# EAGLE design Adafruit Motor Bonnet Rev B (EAGLE 9.6.2)
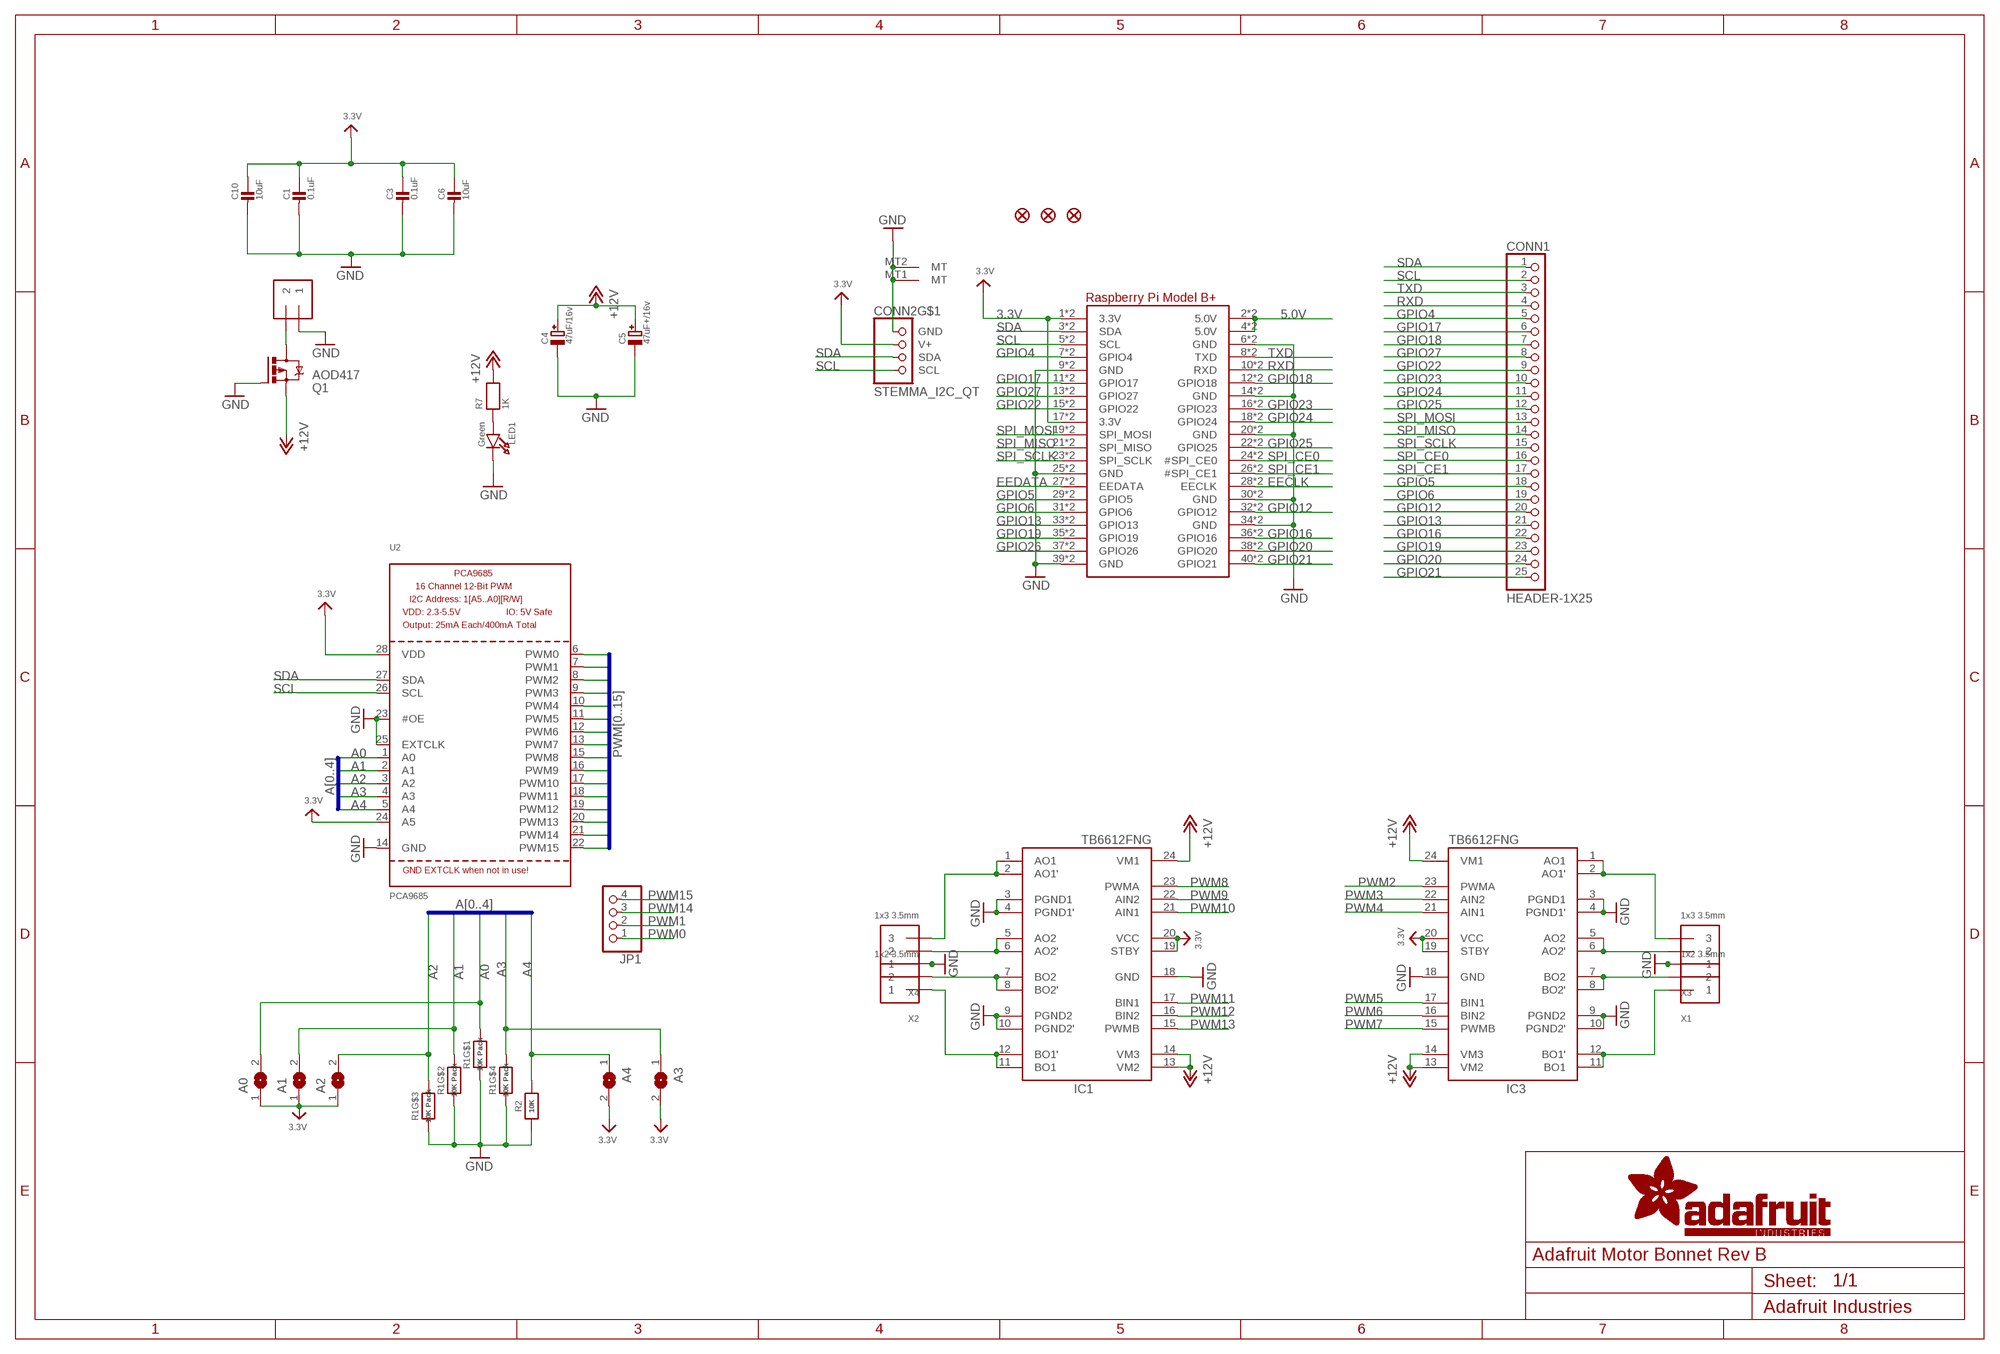
[diagram p0: schematic, sheet 1]

## Parts
A0  SOLDERJUMPERREFLOW_NOPASTE  [SOLDERJUMPER_REFLOW_NOPASTE]
A1  SOLDERJUMPERREFLOW_NOPASTE  [SOLDERJUMPER_REFLOW_NOPASTE]
A2  SOLDERJUMPERREFLOW_NOPASTE  [SOLDERJUMPER_REFLOW_NOPASTE]
A3  SOLDERJUMPERREFLOW_NOPASTE  [SOLDERJUMPER_REFLOW_NOPASTE]
A4  SOLDERJUMPERREFLOW_NOPASTE  [SOLDERJUMPER_REFLOW_NOPASTE]
C1  0.1uF  CAP_CERAMIC0603_NO  [0603-NO]
C3  0.1uF  CAP_CERAMIC0603_NO  [0603-NO]
C4  47uF/16v  CAP_ELECTROLYTICPANASONIC_C  [PANASONIC_C]
C5  47uF+/16v  CAP_ELECTROLYTICPANASONIC_C  [PANASONIC_C]
C6  10uF  CAP_CERAMIC0805-NOOUTLINE  [0805-NO]
C10  10uF  CAP_CERAMIC0805-NOOUTLINE  [0805-NO]
CONN1  HEADER-1X25  [1X25_ROUND_70MIL]
CONN2  STEMMA_I2C_QT  [JST_SH4]
FID1  FIDUCIAL_1MM  [FIDUCIAL_1MM]
FID2  FIDUCIAL_1MM  [FIDUCIAL_1MM]
FID3  FIDUCIAL_1MM  [FIDUCIAL_1MM]
IC1  TB6612FNG  [SSOP24]
IC3  TB6612FNG  [SSOP24]
JP1  HEADER-1X4ROUND  [1X04_ROUND]
LED1  Green  LED0805_NOOUTLINE  [CHIPLED_0805_NOOUTLINE]
MPOWER  1x2 3.5mm  TERMBLOCK_1X2_3.5MM  [TERMBLOCK_1X2-3.5MM]
Q1  AOD417  IRFR5305  [D-PAK_TO252AA]
R1  10K Pack  RESISTOR_4PACK  [RESPACK_4X0603]
R2  10K  RESISTOR_0603_NOOUT  [0603-NO]
R7  1K  RESISTOR_0603_NOOUT  [0603-NO]
RPI1  RASPBERRYPI_BPLUS_BONNET_THMSMT  [PI_BONNET_THMSMT]
U2  PCA9685  [TSSOP28]
X1  1x2 3.5mm  TERMBLOCK_1X2_3.5MM  [TERMBLOCK_1X2-3.5MM]
X2  1x2 3.5mm  TERMBLOCK_1X2_3.5MM  [TERMBLOCK_1X2-3.5MM]
X3  1x3 3.5mm  TERMBLOCK_1X3  [TERMBLOCK_1X3-3.5MM]
X4  1x3 3.5mm  TERMBLOCK_1X3  [TERMBLOCK_1X3-3.5MM]

## Nets
3.3V: A0.1 A1.1 A2.1 A3.2 A4.2 C1.1 C3.1 C6.1 C10.1 CONN2.2(V+) IC1.19(STBY) IC1.20(VCC) IC3.19(STBY) IC3.20(VCC) RPI1.1(3.3V) RPI1.17(3.3V) RPI1.S1(3.3V) RPI1.S17(3.3V) U2.24(A5) U2.28(VDD)
5.0V: RPI1.2(5.0V) RPI1.4(5.0V) RPI1.S2(5.0V) RPI1.S4(5.0V)
+12V: C4.+ C5.+ IC1.13(VM2) IC1.14(VM3) IC1.24(VM1) IC3.13(VM2) IC3.14(VM3) IC3.24(VM1) Q1.3(S) R7.2
A0: A0.2 R1.8 U2.1(A0)
A1: A1.2 R1.7 U2.2(A1)
A2: A2.2 R1.6 U2.3(A2)
A3: A3.1 R1.5 U2.4(A3)
A4: A4.1 R2.2 U2.5(A4)
EECLK: RPI1.28(EECLK) RPI1.S28(EECLK)
EEDATA: RPI1.27(EEDATA) RPI1.S27(EEDATA)
GND: C1.2 C3.2 C4.- C5.- C6.2 C10.2 CONN2.1(GND) CONN2.MT1(MT) CONN2.MT2(MT) IC1.3(PGND1) IC1.4(PGND1') IC1.9(PGND2) IC1.10(PGND2') IC1.18(GND) IC3.3(PGND1) IC3.4(PGND1') IC3.9(PGND2) IC3.10(PGND2') IC3.18(GND) LED1.C MPOWER.1 Q1.1(G) R1.1 R1.2 R1.3 R1.4 R2.1 RPI1.6(GND) RPI1.9(GND) RPI1.14(GND) RPI1.20(GND) RPI1.25(GND) RPI1.30(GND) RPI1.34(GND) RPI1.39(GND) RPI1.S6(GND) RPI1.S9(GND) RPI1.S14(GND) RPI1.S20(GND) RPI1.S25(GND) RPI1.S30(GND) RPI1.S34(GND) RPI1.S39(GND) U2.14(GND) U2.23(#OE) U2.25(EXTCLK) X3.1 X4.1
GPIO4: CONN1.5 RPI1.7(GPIO4) RPI1.S7(GPIO4)
GPIO5: CONN1.18 RPI1.29(GPIO5) RPI1.S29(GPIO5)
GPIO6: CONN1.19 RPI1.31(GPIO6) RPI1.S31(GPIO6)
GPIO12: CONN1.20 RPI1.32(GPIO12) RPI1.S32(GPIO12)
GPIO13: CONN1.21 RPI1.33(GPIO13) RPI1.S33(GPIO13)
GPIO16: CONN1.22 RPI1.36(GPIO16) RPI1.S36(GPIO16)
GPIO17: CONN1.6 RPI1.11(GPIO17) RPI1.S11(GPIO17)
GPIO18: CONN1.7 RPI1.12(GPIO18) RPI1.S12(GPIO18)
GPIO19: CONN1.23 RPI1.35(GPIO19) RPI1.S35(GPIO19)
GPIO20: CONN1.24 RPI1.38(GPIO20) RPI1.S38(GPIO20)
GPIO21: CONN1.25 RPI1.40(GPIO21) RPI1.S40(GPIO21)
GPIO22: CONN1.9 RPI1.15(GPIO22) RPI1.S15(GPIO22)
GPIO23: CONN1.10 RPI1.16(GPIO23) RPI1.S16(GPIO23)
GPIO24: CONN1.11 RPI1.18(GPIO24) RPI1.S18(GPIO24)
GPIO25: CONN1.12 RPI1.22(GPIO25) RPI1.S22(GPIO25)
GPIO26: RPI1.37(GPIO26) RPI1.S37(GPIO26)
GPIO27: CONN1.8 RPI1.13(GPIO27) RPI1.S13(GPIO27)
M1A: IC1.1(AO1) IC1.2(AO1') X4.3
M1B: IC1.5(AO2) IC1.6(AO2') X4.2
M2A: IC1.11(BO1) IC1.12(BO1') X2.1
M2B: IC1.7(BO2) IC1.8(BO2') X2.2
M3A: IC3.1(AO1) IC3.2(AO1') X3.3
M3B: IC3.5(AO2) IC3.6(AO2') X3.2
M4A: IC3.11(BO1) IC3.12(BO1') X1.1
M4B: IC3.7(BO2) IC3.8(BO2') X1.2
N$1: LED1.A R7.1
PWM0: JP1.1 U2.6(PWM0)
PWM1: JP1.2 U2.7(PWM1)
PWM2: IC3.23(PWMA) U2.8(PWM2)
PWM3: IC3.22(AIN2) U2.9(PWM3)
PWM4: IC3.21(AIN1) U2.10(PWM4)
PWM5: IC3.17(BIN1) U2.11(PWM5)
PWM6: IC3.16(BIN2) U2.12(PWM6)
PWM7: IC3.15(PWMB) U2.13(PWM7)
PWM8: IC1.23(PWMA) U2.15(PWM8)
PWM9: IC1.22(AIN2) U2.16(PWM9)
PWM10: IC1.21(AIN1) U2.17(PWM10)
PWM11: IC1.17(BIN1) U2.18(PWM11)
PWM12: IC1.16(BIN2) U2.19(PWM12)
PWM13: IC1.15(PWMB) U2.20(PWM13)
PWM14: JP1.3 U2.21(PWM14)
PWM15: JP1.4 U2.22(PWM15)
RXD: CONN1.4 RPI1.10(RXD) RPI1.S10(RXD)
SCL: CONN1.2 CONN2.4(SCL) RPI1.5(SCL) RPI1.S5(SCL) U2.26(SCL)
SDA: CONN1.1 CONN2.3(SDA) RPI1.3(SDA) RPI1.S3(SDA) U2.27(SDA)
SPI_CE0: CONN1.16 RPI1.24(#SPI_CE0) RPI1.S24(#SPI_CE0)
SPI_CE1: CONN1.17 RPI1.26(#SPI_CE1) RPI1.S26(#SPI_CE1)
SPI_MISO: CONN1.14 RPI1.21(SPI_MISO) RPI1.S21(SPI_MISO)
SPI_MOSI: CONN1.13 RPI1.19(SPI_MOSI) RPI1.S19(SPI_MOSI)
SPI_SCLK: CONN1.15 RPI1.23(SPI_SCLK) RPI1.S23(SPI_SCLK)
TXD: CONN1.3 RPI1.8(TXD) RPI1.S8(TXD)
VMOTOR: MPOWER.2 Q1.4(D)

## Buses
PWM[0..15]
A[0..4]

## Library data of the parts
A0 A1-A4 = microbuilder:SOLDERJUMPER: SMD Solder JUMPER Solder the two pads together to create a connection, or remove the solder to break it. REFLOW - Use this footprint for solder paste and reflow ovens. WAVE - Use this footprint for hand-soldering (larger pads). CLOSED - Has a trace between the two pads to ensure it is closed by default. The trace needs to be cut to disable the jumper, and can be closed again by creating a solder bridge between the two pads.
C1 C3 C6 C10 = microbuilder:CAP_CERAMIC: Ceramic Capacitors For new designs, use the packages preceded by an '_' character since they are more reliable: The following footprints should be used on most boards: _0402 - Standard footprint for regular board layouts _0603 - Standard footprint for regular board layouts _0805 - Standard footprint for regular board layouts _1206 - Standard footprint for regular board layouts For extremely tight-pitch boards where space is at a premium, the following 'micro-pitch' footprints can be used (smaller pads, no silkscreen outline, etc.): _0402MP - Micro-pitch footprint for very dense/compact boards _0603MP - Micro-pitch footprint for very dense/compact boards _0805MP - Micro-pitch footprint for very dense/compact boards _1206MP - Micro-pitch footprint for very dense/compact boards
C4 C5 = microbuilder:CAP_ELECTROLYTIC: Electrolytic Capacitors SMT PANASONIC_C - Size C Panasonic Electrolytic Aluminum Capacitor 47µF 16V 20% Electrolytic Capacitor [Digikey: PCE3890TR-ND] PANASONIC_D - Size D Panasonic Electrolytic Aluminum Capacitor 100µF 25V 20% Electrolytic Capacitor [Digikey: PCE3898TR-ND] PTH 3.5 mm grid, 8 mm diameter ... 3.5 mm grid, 10 mm diameter ...
CONN1 = microbuilder:HEADER-1X25
CONN2 = adafruit_electromech:STEMMA_I2C; LCSC: C2905006
FID1-FID3 = microbuilder:FIDUCIAL: Fiducial Alignment Points Various fiducial points for machine vision alignment.; BOM: EXCLUDE
IC1 IC3 = adafruit:TB6612FNG: TB6612FNG MOS dual H-bridge motor driver, 1.2A current 3.2A peak 3 or 5v logic and 3-15v motor
JP1 = microbuilder:HEADER-1X4: PIN HEADER
LED1 = microbuilder:LED: LED 0603 - 0603 Surface Mount Package 2mA: Green LED - Low Power (3.9mcd, 2ma, 1.7Vf) - Digikey: 475-2709-2-ND Orange LED - Low Power (9.8mcd, 2ma, 1.8Vf) - Digikey: 475-1194-2-ND Red LED - Low Power (5mcd, 2ma, 1.8Vf) - Digikey: 475-1195-2-ND Yellow LED - Low Power (7mcd, 2ma, 1.8Vf) - Digikey: 475-1196-2-ND 5mA: Blue LED - Low Power (17mcd, 5ma, 2.9Vf) - Digikey: LNJ937W8CRACT-ND 0805 - 0805 Surface Mount Package 2mA: Red LED (8.8mcd, 2mA, 1.8Vf, Clear) - Low Power [Digikey: 475-2510-1-ND] Green LED (5mcd, 2mA, 1.8Vf, Clear) - Low Power [Digikey: 475-2730-1-ND] Yellow LED (11.3mcd, 2mA, 1.8Vf, Clear) - Low Power [Digikey: 475-2555-1-ND] 20mA: Red LED (104mcd, 20mA, Diffused) - LS R976 [Digikey: 475-1278-6-ND] Red LED (12mcd, 20mA, 2.0Vf, Clear) - APT2012EC [Digikey: 754-1128-1-ND] Green LED (15mcd, 20mA, 2.2Vf, Clear) - APT2012GC [Digikey: 754-1131-1-ND] Orange LED (160mcd, 20mA, 2.1Vf, Clear) - APT2012SECK [Digikey: 754-1130-1-ND] 1206 - 1206 Surface Mount Package Green LED (26mcd, 20mA, Diffused) - LG N971 [Digikey: 475-1407-6-ND] Red LED (15mcd, 20mA, Diffused) - LH N974 [Digikey: 475-1416-6-ND] Cree - Cree High-Power Surface Mount LEDs XPEBWT-L1-0000-00D50 - White 111lm 350mA 2.9Vf 6200K 110° XTEAWT-00-0000-00000LEE3 - White 114lm 350mA 2.85Vf 5000K 115° Everlight - Everlight 45-21 Series Surface Mount LEDs 45-21/QK2C-B2832AC2CB2/2T - Warm White 2000mcd 20mA 3.25Vf 3050K 120° 45-21/LK2C-B38452C4CB2/2T - Nuetral White 2000mcd 20mA 3.25Vf 4150K 120° 45-21/LK2C-B50634C6CB2/2T - Cold White 2200mcd 20mA 3.25Vf 5650K 120° PLCC2 Reverse Mount LS T77K-J1L2-1-0-2-R18-Z - Red 11.25mcd 2mA 1.8Vf 630nm 120° LO T77K-L1M2-24-Z - Orange 19.6mcd 2mA 1.8Vf 606nm 120° LY T77K-K2M1-26-Z - Yellow 15.7mcd 2mA 1.8Vf 587nm 120°; ROT: 270
MPOWER X1 X2 = adafruit_electromech:TERMBLOCK_1X2: 3.5mm Terminal block http://www.ladyada.net/library/pcb/eaglelibrary.html; ROT: 0
Q1 = transistor-power:IRF?5305: HEXFET Power MOSFET Source: http://www.irf.com/product-info/datasheets/data/irfr5305pbf.pdf
R1 = microbuilder:RESISTOR_4PACK: Resistor Packs (4 resistors) 4 x 0603 10K 1/16W - Digikey: YC164J-10KCT-ND
R2 R7 = microbuilder:RESISTOR: Resistors For new designs, use the packages preceded by an '_' character since they are more reliable: The following footprints should be used on most boards: _0402 - Standard footprint for regular board layouts _0603 - Standard footprint for regular board layouts _0805 - Standard footprint for regular board layouts _1206 - Standard footprint for regular board layouts For extremely tight-pitch boards where space is at a premium, the following 'micro-pitch' footprints can be used (smaller pads, no silkscreen outline, etc.): _0402MP - Micro-pitch footprint for very dense/compact boards _0603MP - Micro-pitch footprint for very dense/compact boards _0805MP - Micro-pitch footprint for very dense/compact boards _1206MP - Micro-pitch footprint for very dense/compact boards
RPI1 = adafruit_sbc:RASPBERRYPI_BPLUS
U2 = microbuilder:PCA9685: PCA9685 - 16 Channel 12-Bit I2C PWM Controller 5.0V tolerant 16 channel, 12-bit I2C PWM controller with 25mA per output (max. 400mA total) Digikey: 568-5931-1-ND
X3 X4 = adafruit_electromech:TERMBLOCK_1X3: 3.5mm Terminal block http://www.ladyada.net/library/pcb/eaglelibrary.html

## Board
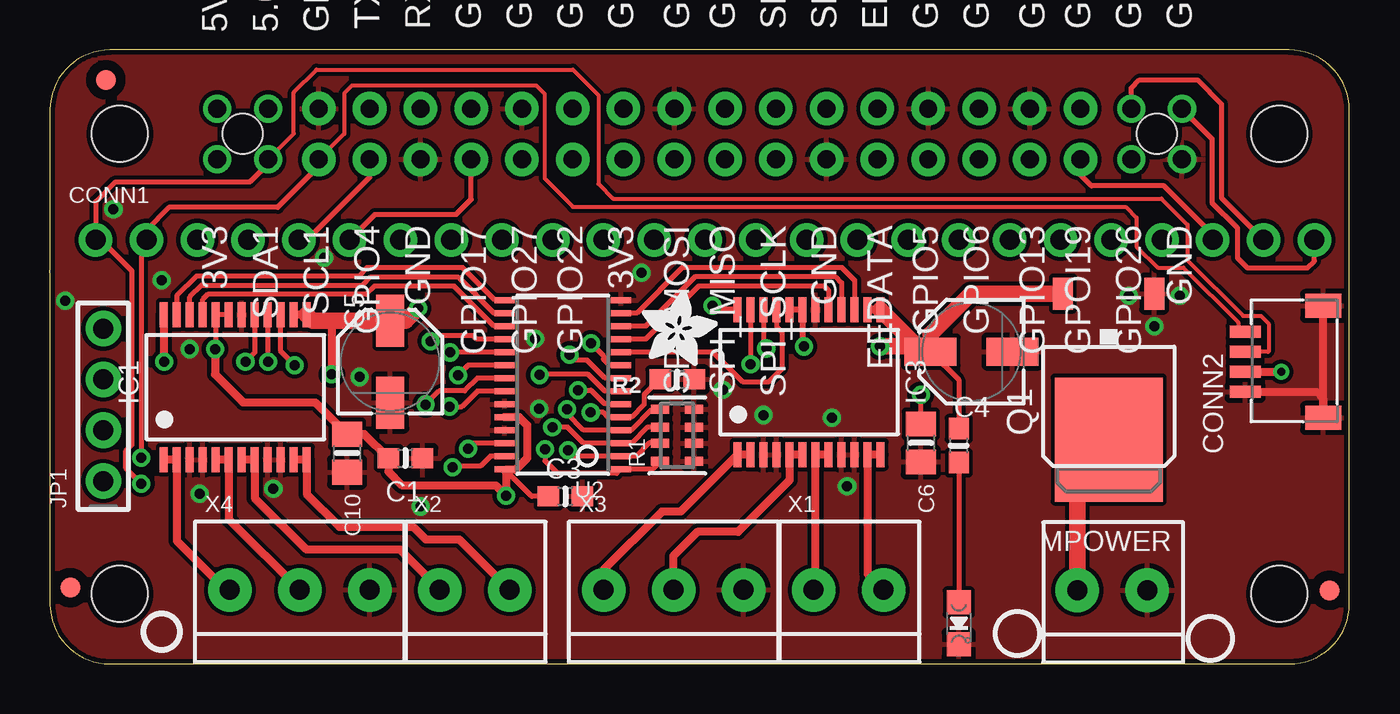
[diagram p1: board, top side]
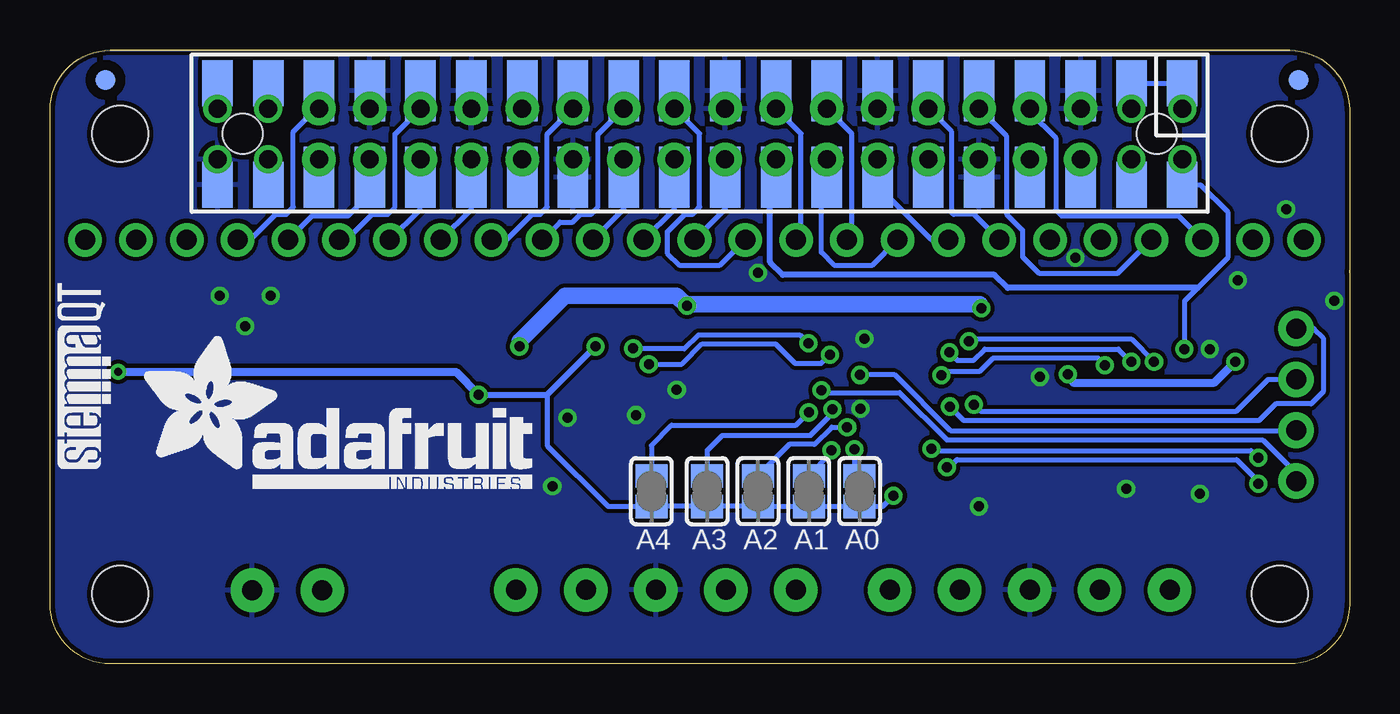
[diagram p2: board, bottom side, seen from below]

Size 65 x 30.7 mm. Coordinates in mm from the lower left corner, seen from the top.
Outline: 0,19.56 0,19.68
Outline: 0,27.7 0,3 arc90 3,0 62,0 arc90 65,3 65,27.7 arc90 62,30.7 3,30.7 arc90 0,27.7
Copper layers (1*16): Top 0.035mm / dielectric 1.5mm / Bottom 0.035mm
Design rules "adafruit *": minimum track width 8mil, minimum drill 15.5mil, track to track 8mil, track to pad 8mil, pad to pad 8mil, via to via 8mil, smd to smd 8mil, copper to edge 10mil, drill to drill 8mil, minimum pad ring 10mil, minimum via ring 8mil, stop-mask expansion 2mil, vias tented up to drill 20mil, thermal gap 10mil

### Footprints (pad centres in the part's own frame; a part is rotated, then mirrored left to right if it is on the bottom)
SOLDERJUMPER_REFLOW_NOPASTE = smd 1.168 x 1.6: 1 -0.762,0; 2 0.762,0
0603-NO = smd 1.075 x 1: 1 -0.85,0; 2 0.85,0
PANASONIC_C = smd 2.6 x 1.4: + 2.05,0; - -2.05,0
0805-NO = smd 1.24 x 1.5: 1 -0.95,0; 2 0.95,0
1X25_ROUND_70MIL = drill 1 pad 1.676: 1 -30.48,0; 2 -27.94,0; 3 -25.4,0; 4 -22.86,0; 5 -20.32,0; 6 -17.78,0; 7 -15.24,0; 8 -12.7,0; 9 -10.16,0; 10 -7.62,0; 11 -5.08,0; 12 -2.54,0; 13 0,0; 14 2.54,0; 15 5.08,0; 16 7.62,0; 17 10.16,0; 18 12.7,0; 19 15.24,0; 20 17.78,0; 21 20.32,0; 22 22.86,0; 23 25.4,0; 24 27.94,0; 25 30.48,0
JST_SH4 = smd 0.6 x 1.55: 1 -1.5,2.006; 2 -0.5,2.006; 3 0.5,2.006; 4 1.5,2.006 | smd 1.2 x 1.8: MT1 -2.8,-1.894; MT2 2.8,-1.894
FIDUCIAL_1MM = smd 1 x 1: 1 0,0
SSOP24 = smd 0.4 x 1.25: 1 -3.575,-3.625; 2 -2.925,-3.625; 3 -2.275,-3.625; 4 -1.625,-3.625; 5 -0.975,-3.625; 6 -0.325,-3.625; 7 0.325,-3.625; 8 0.975,-3.625; 9 1.625,-3.625; 10 2.275,-3.625; 11 2.925,-3.625; 12 3.575,-3.625; 13 3.575,3.625; 14 2.925,3.625; 15 2.275,3.625; 16 1.625,3.625; 17 0.975,3.625; 18 0.325,3.625; 19 -0.325,3.625; 20 -0.975,3.625; 21 -1.625,3.625; 22 -2.275,3.625; 23 -2.925,3.625; 24 -3.575,3.625
1X04_ROUND = drill 1 pad 1.778: 1 -3.81,0; 2 -1.27,0; 3 1.27,0; 4 3.81,0
CHIPLED_0805_NOOUTLINE = smd 1.2 x 1.2: A 0,-1.05; C 0,1.05
TERMBLOCK_1X2-3.5MM = drill 1 pad 2.184: 1 1.8,0; 2 -1.7,0
D-PAK_TO252AA = smd 1 x 1.6: 1 -2.28,-4.8; 3 2.28,-4.8 | smd 5.4 x 6.2: 4 0,2.5
RESPACK_4X0603 = smd 0.45 x 0.9: 1 -1.3,-0.85; 2 -0.4,-0.85; 3 0.4,-0.85; 4 1.3,-0.85; 5 1.3,0.85; 6 0.4,0.85; 7 -0.4,0.85; 8 -1.3,0.85
PI_BONNET_THMSMT = drill 0.9 pad 1.27: 1 -24.13,-1.27; 2 -24.13,1.27; 3 -21.59,-1.27; 4 -21.59,1.27; 37 21.59,-1.27; 38 21.59,1.27; 39 24.13,-1.27; 40 24.13,1.27 | drill 0.9 pad 1.676: 5 -19.05,-1.27; 6 -19.05,1.27; 7 -16.51,-1.27; 8 -16.51,1.27; 9 -13.97,-1.27; 10 -13.97,1.27; 11 -11.43,-1.27; 12 -11.43,1.27; 13 -8.89,-1.27; 14 -8.89,1.27; 15 -6.35,-1.27; 16 -6.35,1.27; 17 -3.81,-1.27; 18 -3.81,1.27; 19 -1.27,-1.27; 20 -1.27,1.27; 21 1.27,-1.27; 22 1.27,1.27; 23 3.81,-1.27; 24 3.81,1.27; 25 6.35,-1.27; 26 6.35,1.27; 27 8.89,-1.27; 28 8.89,1.27; 29 11.43,-1.27; 30 11.43,1.27; 31 13.97,-1.27; 32 13.97,1.27; 33 16.51,-1.27; 34 16.51,1.27; 35 19.05,-1.27; 36 19.05,1.27 | smd 1 x 1 bottom: 41 -29.96,2.71; 42 29.73,2.71 | smd 1.524 x 2.286 bottom: S1 -24.13,-2.542; S2 -24.13,2.538; S3 -21.59,-2.542; S4 -21.59,2.538; S37 21.59,-2.542; S38 21.59,2.538; S39 24.13,-2.542; S40 24.13,2.538 | smd 1.524 x 2.54 bottom: S5 -19.05,-2.415 | smd 1.524 x 3.048 bottom: S6 -19.05,2.157; S7 -16.51,-2.161; S8 -16.51,2.157; S9 -13.97,-2.161; S10 -13.97,2.157; S11 -11.43,-2.161; S12 -11.43,2.157; S13 -8.89,-2.161; S14 -8.89,2.157; S15 -6.35,-2.161; S16 -6.35,2.157; S17 -3.81,-2.161; S18 -3.81,2.157; S19 -1.27,-2.161; S20 -1.27,2.157; S21 1.27,-2.161; S22 1.27,2.157; S23 3.81,-2.161; S24 3.81,2.157; S25 6.35,-2.161; S26 6.35,2.157; S27 8.89,-2.161; S28 8.89,2.157; S29 11.43,-2.161; S30 11.43,2.157; S31 13.97,-2.161; S32 13.97,2.157; S33 16.51,-2.161; S34 16.51,2.157; S35 19.05,-2.161; S36 19.05,2.157 | hole 2.8: -29,0; 29,0; 29,-23; -29,-23 | hole 2: -22.86,0; 22.86,0
TSSOP28 = smd 0.305 x 0.991: 1 -4.225,-2.918; 2 -3.575,-2.918; 3 -2.925,-2.918; 4 -2.275,-2.918; 5 -1.625,-2.918; 6 -0.975,-2.918; 7 -0.325,-2.918; 8 0.325,-2.918; 9 0.975,-2.918; 10 1.625,-2.918; 11 2.275,-2.918; 12 2.925,-2.918; 13 3.575,-2.918; 14 4.225,-2.918; 15 4.225,2.918; 16 3.575,2.918; 17 2.925,2.918; 18 2.275,2.918; 19 1.625,2.918; 20 0.975,2.918; 21 0.325,2.918; 22 -0.325,2.918; 23 -0.975,2.918; 24 -1.625,2.918; 25 -2.275,2.918; 26 -2.925,2.918; 27 -3.575,2.918; 28 -4.225,2.918
TERMBLOCK_1X3-3.5MM = drill 1 pad 2.184: 1 3.5,0; 2 0,0; 3 -3.5,0

### Placement (x,y rotation side)
A0  24.51,8.64 90 bottom
A1  27.05,8.64 90 bottom
A2  29.59,8.64 90 bottom
A3  32.13,8.64 270 bottom
A4  34.92,8.64 270 bottom
C1  17.78,10.29 0 top
C3  25.78,8.38 0 top
C4  46.1,15.62 180 top
C5  17.02,15.11 90 top
C6  43.56,11.05 270 top
C10  14.86,10.54 270 top
CONN1  32.77,21.21 0 top
CONN2  61.8,15.1 90 top
FID1  2.79,29.21 0 top
FID2  64.01,3.68 0 top
FID3  1.02,3.81 0 top
IC1  9.27,13.84 0 top
IC3  37.97,14.1 0 top
JP1  2.67,12.95 90 top
LED1  45.47,2.03 180 top
MPOWER  53.09,3.68 0 top
PLABEL0  [PLABEL0]  2.41,19.3 0 top
PLABEL1  [PLABEL1]  4.83,22.86 0 top
PLABEL2  [PLABEL2]  7.49,19.3 0 top
PLABEL3  [PLABEL3]  10.03,22.86 0 top
PLABEL4  [PLABEL4]  12.45,19.3 0 top
PLABEL5  [PLABEL5]  14.99,22.86 0 top
PLABEL6  [PLABEL6]  17.53,19.3 0 top
PLABEL7  [PLABEL7]  20.19,22.99 0 top
PLABEL8  [PLABEL8]  22.48,19.3 0 top
PLABEL9  [PLABEL9]  24.89,22.99 0 top
PLABEL10  [PLABEL10]  27.43,19.3 0 top
PLABEL11  [PLABEL11]  30.1,22.99 0 top
PLABEL12  [PLABEL12]  32.77,19.43 0 top
PLABEL13  [PLABEL13]  35.31,22.99 0 top
PLABEL14  [PLABEL14]  37.85,19.3 0 top
PLABEL15  [PLABEL15]  40.39,22.99 0 top
PLABEL16  [PLABEL16]  42.93,19.3 0 top
PLABEL17  [PLABEL17]  45.47,22.99 0 top
PLABEL18  [PLABEL18]  48.01,19.3 0 top
PLABEL19  [PLABEL19]  50.29,22.99 0 top
PLABEL20  [PLABEL20]  52.96,19.43 0 top
PLABEL21  [PLABEL21]  55.37,22.99 0 top
PLABEL22  [PLABEL22]  57.91,19.43 0 top
PLABEL23  [PLABEL23]  60.45,22.99 0 top
PLABEL24  [PLABEL24]  63.25,19.3 0 top
PLABEL25  [PLABEL25]  58.45,12.53 90 top
PLABEL26  [PLABEL26]  8.83,7.57 0 top
PLABEL27  [PLABEL27]  19.49,7.57 0 top
PLABEL28  [PLABEL28]  14.01,7.46 0 top
PLABEL29  [PLABEL29]  38.06,7.44 0 top
PLABEL30  [PLABEL30]  27.72,7.54 0 top
PLABEL31  [PLABEL31]  32.88,7.62 0 top
PLABEL33  [PLABEL33]  44.38,6.38 0 top
PLABEL34  [PLABEL34]  47.35,0.89 0 top
PLABEL35  [PLABEL35]  57.5,0.68 0 top
PLABEL36  [PLABEL36]  1.14,15.75 90 top
PLABEL37  [PLABEL37]  1.14,13.34 90 top
PLABEL38  [PLABEL38]  1.14,10.54 90 top
PLABEL39  [PLABEL39]  1.14,7.86 90 top
PLABEL40  [PLABEL40]  2.67,6.25 0 top
PLABEL41  [PLABEL41]  24.26,11.56 90 bottom
PLABEL42  [PLABEL42]  27,11.56 90 bottom
PLABEL43  [PLABEL43]  29.64,11.56 90 bottom
PLABEL44  [PLABEL44]  32.08,11.56 90 bottom
PLABEL45  [PLABEL45]  34.97,11.56 90 bottom
PLABEL46  [PLABEL46]  29.59,6.22 0 bottom
PLABEL47  [PLABEL47]  57.53,5.21 0 top
Q1  52.96,13.72 180 top
R1  31.37,11.43 90 top
R2  31.37,14.22 180 top
R7  45.47,10.92 90 top
RPI1  32.5,26.5 0 top
U2  25.65,13.97 90 top
U$6  [PCBFEAT-REV-040]  5.59,1.61 0 top
U$8  [ADAFRUIT_TEXT_20MM]  60.45,8.76 0 bottom
U$14  [ADAFRUIT_3.5MM]  29.6,14.9 0 top
U$15  [STEMMAQT]  61.98,9.78 90 bottom
X1  39.9,3.7 0 top
X2  21.2,3.7 0 top
X3  31.2,3.7 0 top
X4  12.5,3.7 0 top

### Tracks (layer width: path | path; a pad name or v marks a point on that pad's centre or on a via)
3.3V  (via drill 0.39, 0.5)
  Top 0.254: U2.28 22.78,9.7 22.84,9.64 24.1,8.38 C3.1 | IC1.19 IC1.20 8.3,15.79 v8.26,15.75 | C6.1 v43.56,13.46
  Top 0.305: IC3.20 IC3.19 37.65,15.95 v37.72,15.88
  Top 0.406: 22.84,9.64 22.81,9.6 v22.81,8.42 22.31,8.92 17.63,8.92 16.93,9.61 C1.1 15.73,11.49 C10.1 13.27,13.08 9.65,13.08 8.26,14.48 v8.26,15.75 | U2.24 23.47,12.35 23.88,11.94 23.88,10.29 23.29,9.7 22.78,9.7 | CONN2.2 v61.59,14.6 v61.59,14.61
  Bottom 0.254: 40.13,13.46 40.13,10.92 37.08,7.87 A4.2 A3.2 A2.1 A1.1 A0.1 23.35,7.87 v22.81,8.42 | RPI1.1 RPI1.S1 7.46,23.96 6.1,22.6 6.1,20.3 7.6,18.8 8.26,18.14 v8.26,15.75 | RPI1.1 | RPI1.S17 RPI1.17 | RPI1.17
  Bottom 0.305: v37.72,15.88 40.13,13.46 v43.56,13.46 | 7.6,18.8 17.1,18.8 17.76,19.46 28.35,19.46 28.98,20.09 28.98,24.05 RPI1.S17
  Bottom 0.406: v61.59,14.61 44.7,14.61 v43.56,13.46
5.0V
  Bottom 0.254: RPI1.S2 | RPI1.S2 RPI1.2 | RPI1.S4 | RPI1.S4 RPI1.4 | RPI1.S4 RPI1.S2 | RPI1.S2
+12V  (via drill 0.5)
  Top 0.254: C4.+ 45.47,14.21 R7.2
  Top 0.305: IC3.24 33.33,17.72 v33.15,17.91 | C4.+ 43.8,15.88
  Top 0.406: IC1.13 IC1.14 | IC1.24 5.7,15.13 v5.71,15.11 | v14.1,14.48 14.1,17.04 13.97,17.16 | IC3.13 IC3.14 | 43.65,15.62 C4.+ 44.05,16.49 | 17.8,17.16 C5.+
  Top 0.813: C5.+ 13.97,17.16 13.15,17.16 IC1.13 | 43.65,15.62 IC3.13 | 43.8,15.88 v41.53,15.88 | Q1.3 46.08,18.52 44.05,16.49 | v18.41,17.78 17.8,17.16
  Bottom 0.406: v5.71,15.11 6.76,14.07 13.82,14.07 14.1,14.35 v14.1,14.48 | 18.49,17.99 18.29,17.78 v18.41,17.78
  Bottom 0.813: v41.53,15.88 41.53,16.13 39.24,18.41 33.66,18.41 v33.15,17.91 33.07,17.99 18.49,17.99
A0  (via drill 0.5)
  Top 0.254: R1.8 30.13,9.74 U2.1 28.35,9.53 25.4,9.53 24.77,10.16 v24.77,10.73
  Bottom 0.254: v24.77,10.73 24.77,9.46 24.7,9.4 A0.2
A1  (via drill 0.5)
  Top 0.254: R1.7 30.5,11.05 29.97,11.05 29.32,10.39 U2.2 26.2,10.39 v25.91,10.68
  Bottom 0.254: v25.91,10.68 25.91,10.56 27.05,9.41 A1.2
A2  (via drill 0.5)
  Top 0.254: R1.6 29.86,11.83 29.08,11.04 U2.3 26.7,11.04 25.9,11.84 v25.13,11.84
  Bottom 0.254: v25.13,11.84 25.9,11.84 26.77,10.97 28.02,10.97 A2.2
A3  (via drill 0.5)
  Top 0.254: R1.5 30.12,12.73 29.08,11.7 U2.4 26.69,11.7 25.86,12.53 v25.86,12.73
  Bottom 0.254: A3.1 32.13,10.67 31.37,11.43 26.96,11.43 25.86,12.53 v25.86,12.73
A4  (via drill 0.5)
  Top 0.254: R2.2 30.48,14.22 29.72,13.46 29.72,12.98 29.09,12.35 U2.5 27.91,12.35 27.69,12.57 v27.05,12.57
  Bottom 0.254: v27.05,12.57 27.69,11.94 33.91,11.94 34.92,10.92 A4.1
EECLK
  Bottom 0.254: RPI1.S28 | RPI1.S28 RPI1.28
EEDATA
  Bottom 0.406: RPI1.S27 RPI1.27 | RPI1.27
GND  (via drill 0.5)
  Top 0.406: CONN2.1 63.36,13.6 63.69,13.27 CONN2.MT1 CONN2.MT2
  other vias: 0.76,18.16 29.59,19.56 13.72,20.32 6.99,15.75 5.59,19.18 7.49,8.51 18.54,7.87 15.49,14.35 24.26,16.26 35.69,12.45 33.66,13.72 39.12,12.32 39.88,8.89 11.18,8.76 53.98,18.41 55.24,16.89 56.52,18.41 24.46,12.76 3.17,22.73
  pour Top: 0,0 64.9,0 64.9,30.48 0,30.48
  pour Bottom: 0,0 64.9,0 64.9,30.48 0,30.48
GPIO4
  Top 0.254: RPI1.7 RPI1.S7 12.87,21.21 CONN1.5
  Bottom 0.254: RPI1.S7 RPI1.7 | RPI1.7
GPIO5
  Bottom 0.254: CONN1.18 43.93,22.75 RPI1.S29 RPI1.29 | RPI1.29
GPIO6
  Bottom 0.254: CONN1.19 46.5,22.71 46.5,24.31 RPI1.S31 RPI1.31 | RPI1.31
GPIO12
  Bottom 0.254: CONN1.20 50.16,21.21 48.89,22.48 48.11,22.48 47.75,22.84 47.75,26.49 RPI1.32
  Bottom 0.406: RPI1.S32 | RPI1.S32 RPI1.32
GPIO13
  Bottom 0.254: CONN1.21 51.9,22.4 50.1,22.4 49,23.5 RPI1.S33 RPI1.33 | RPI1.33
GPIO16
  Bottom 0.254: CONN1.22 54.99,21.21 53.72,22.48 53.19,22.48 52.83,22.84 52.83,26.62 51.55,27.9
  Bottom 0.406: RPI1.S36 | RPI1.S36 51.55,27.9 RPI1.36
GPIO17
  Top 0.254: CONN1.6 16.26,22.48 20.32,22.48 21.07,23.23 RPI1.11
  Bottom 0.406: RPI1.S11 RPI1.11 | RPI1.11
GPIO18
  Bottom 0.254: CONN1.7 18.8,22.48 19.81,22.48 19.9,22.57 19.9,26.6 RPI1.12 RPI1.S12 | RPI1.S12
GPIO19
  Top 0.254: CONN1.23 58.17,21.46 55.73,23.9 52.1,23.9 51.55,24.45 RPI1.35
  Bottom 0.254: RPI1.S35 RPI1.35 | RPI1.35
GPIO20
  Top 0.254: RPI1.38 54.09,28.79 54.5,29.2 57.4,29.2 58.61,27.99 58.61,23.31 CONN1.24
  Bottom 0.406: RPI1.S38 RPI1.38 | RPI1.38
GPIO21
  Top 0.254: CONN1.25 63.25,20.15 62.9,19.8 59.9,19.8 59.4,20.3 59.4,21.8 58.13,23.07 58.13,26.27 RPI1.40
  Bottom 0.406: RPI1.S40 | RPI1.S40 RPI1.40
GPIO22
  Bottom 0.254: CONN1.9 23.88,19.94 25.78,19.94 26.42,20.57 26.42,24.07 RPI1.S15 RPI1.15 | RPI1.15
GPIO23
  Bottom 0.254: CONN1.10 24.89,21.46 24.89,26.51 RPI1.16
  Bottom 0.406: RPI1.S16 | RPI1.S16 RPI1.16
GPIO24
  Bottom 0.254: CONN1.11 27.43,21.46 27.43,26.51 RPI1.18
  Bottom 0.406: RPI1.S18 | RPI1.S18 RPI1.18
GPIO25
  Bottom 0.254: CONN1.12 31.5,19.94 33.53,19.94 34.14,20.55 34.14,21.59 33.24,22.48 32.87,22.48 32.68,22.68 32.68,22.7 32.51,22.86 32.51,26.51 RPI1.22 RPI1.S22 | RPI1.S22
GPIO26
  Bottom 0.254: RPI1.S37 RPI1.37 | RPI1.37
GPIO27
  Bottom 0.254: CONN1.8 20.91,21.21 23.61,23.91 RPI1.S13 RPI1.13 | RPI1.13
M1A
  Top 0.406: IC1.1 IC1.2 6.35,6.15 8.8,3.7 X4.3
M1B
  Top 0.254: IC1.6
  Top 0.406: IC1.5 IC1.6 8.95,7.24 12.48,3.7 X4.2
M2A
  Top 0.406: IC1.11 IC1.12 12.85,8.49 14.48,6.86 18.16,6.86 18.8,6.22 20.48,6.22 X2.1
M2B
  Top 0.406: IC1.7 IC1.8 10.25,8.3 12.83,5.71 17.53,5.71 19.5,3.74 X2.2
M3A
  Top 0.406: IC3.2 IC3.1 31.55,7.62 30.61,7.62 27.67,4.68 27.7,4.66 X3.3
M3B
  Top 0.254: IC3.5
  Top 0.406: IC3.6 IC3.5 37,9.19 34.42,6.6 32.38,6.6 31.17,5.39 31.17,3.73 X3.2
M4A
  Top 0.406: IC3.12 IC3.11 40.9,4.7 40.9,4.5 X1.1
M4B
  Top 0.254: X1.2 38.2,3.71 38.3,3.81
  Top 0.406: IC3.8 IC3.7 38.3,3.81
N$1
  Top 0.254: R7.1 LED1.A
PWM0  (via drill 0.5)
  Top 0.254: v26.42,13.7 27.06,13.7 27.73,13.03 27.88,13.03 27.91,12.99 U2.6
  Bottom 0.254: v26.42,13.7 26.29,13.57 22.51,13.57 20.14,11.21 4.35,11.21 2.67,9.53 JP1.1
PWM1  (via drill 0.5)
  Top 0.254: U2.7 27.76,13.64 26.92,14.48 24.51,14.48 v24.48,14.45
  Bottom 0.254: v24.48,14.45 22.74,14.45 19.95,11.66 2.69,11.66 JP1.2
PWM2  (via drill 0.5)
  Top 0.254: U2.8 27.77,14.29 26.87,15.2 26.27,15.2 v26,15.47 | v35.05,14.99 IC3.23
  Bottom 0.254: v35.05,14.99 33.4,14.99 32.38,16 28.7,16 27.73,15.03 26.43,15.03 v26,15.47
PWM3  (via drill 0.5)
  Top 0.254: U2.9 27.98,14.95 27.69,15.24 27.69,15.42 v27.07,16.04 | v35.83,15.78 35.7,15.91 IC3.22
  Bottom 0.254: v35.83,15.78 33.3,15.78 33.28,15.75 32.57,16.46 27.49,16.46 v27.07,16.04
PWM4
  Top 0.254: U2.10 33.17,15.6 34.67,14.1 35.94,14.1 36.62,14.77 36.62,16.6 36.35,16.86 IC3.21
PWM5
  Top 0.254: U2.11 29.8,16.25 32.45,18.9 38.73,18.9 38.95,18.68 IC3.17
PWM6
  Top 0.254: IC3.16 39.6,19.06 39.31,19.36 32.26,19.36 29.8,16.89 U2.12
PWM7
  Top 0.254: U2.13 29.36,17.55 31.62,19.81 39.62,19.81 40.25,19.19 IC3.15
PWM8
  Top 0.254: IC1.23 6.35,18.41 7.33,19.4 15.44,19.4 15.85,19.81 20.65,19.81 22.27,18.2 U2.15
PWM9
  Top 0.254: IC1.22 7,18.35 7.58,18.94 15.63,18.94 16.04,19.36 20.41,19.36 22.22,17.55 U2.16
PWM10
  Top 0.254: U2.17 22.22,16.89 20.22,18.9 16.23,18.9 15.82,18.48 7.9,18.48 7.65,18.23 IC1.21
PWM11  (via drill 0.5)
  Top 0.254: IC1.17 10.25,15.58 v9.78,15.11 | v19.05,16.14 19.32,16.42 21.17,16.42 21.35,16.25 U2.18
  Bottom 0.254: v9.78,15.11 10.92,16.26 18.94,16.26 v19.05,16.14
PWM12  (via drill 0.5)
  Top 0.254: IC1.16 10.9,15.14 v10.92,15.11 | v20.02,15.57 20.04,15.6 U2.19
  Bottom 0.254: v10.92,15.11 11.56,15.75 18.25,15.75 18.82,15.18 19.62,15.18 v20.02,15.57
PWM13  (via drill 0.5)
  Top 0.254: v20.42,14.44 20.93,14.95 U2.20 | v12.24,14.94 11.55,15.63 IC1.15 | IC1.15
  Bottom 0.254: v12.24,14.94 12.59,15.29 17.83,15.29 18.49,14.64 20.22,14.64 v20.42,14.44
PWM14  (via drill 0.5)
  Top 0.254: U2.21 21.38,14.29 20.74,13.65 19.48,13.65 v18.79,12.97
  Bottom 0.254: v18.79,12.97 18.46,12.64 5.65,12.64 4.06,14.22 JP1.3 | JP1.3
PWM15  (via drill 0.5)
  Top 0.254: U2.22 21.38,13.64 20.61,12.87 v19.99,12.87
  Bottom 0.254: v19.99,12.87 19.29,12.17 4.53,12.17 3.7,13 1.92,13 1.32,13.6 1.32,16.3 1.78,16.76 JP1.4
RXD
  Bottom 0.254: RPI1.S10 | RPI1.S10 RPI1.10 17.14,26.39 17.14,25.73 17.16,25.71 17.16,22.49 16.36,21.69 16.36,20.36 15.54,19.54 11.58,19.54 CONN1.4
SCL  (via drill 0.5)
  Top 0.203: CONN2.4 59.44,16.6 59.44,17.08 56.7,19.81 55.41,19.81 54.36,20.86 54.36,22.32 53.81,22.86 26.16,22.86 24.75,24.27 24.75,28.5 24.34,28.91 15.1,28.91 14.72,28.53 14.72,26.5 RPI1.5
  Top 0.254: U2.26 21.2,11.04 v20.92,10.77 | v4.55,10.3 4.55,20.94 CONN1.2 4.83,21.72 5.94,22.83 11.39,22.83 13.45,24.89 RPI1.5
  Bottom 0.254: v20.92,10.77 20.82,10.67 4.92,10.67 v4.55,10.3 | RPI1.S5 13.55,24.18 13.55,25.13 RPI1.5
SDA  (via drill 0.5)
  Top 0.203: RPI1.3 12.19,26.51 12.19,28.57 13.34,29.72 26.16,29.72 27.43,28.45 27.43,24 28.17,23.27 55.6,23.27 56.9,21.97 56.9,20.19 59.69,17.4 60.58,17.4 60.96,17.02 60.96,15.62 60.94,15.6 CONN2.3
  Top 0.254: U2.27 22.04,10.39 21.54,9.89 20.22,9.89 v20.15,9.83 | v4.57,9.02 3.77,9.82 3.77,10.63 4.1,10.96 4.1,19.65 2.54,21.21 CONN1.1 2.29,23.11 3.27,24.1 10,24.1 10.91,25.01 RPI1.3
  Bottom 0.254: v4.57,9.02 4.45,9.02 5.64,10.21 19.63,10.21 19.96,9.88 20.09,9.88 v20.15,9.83 | RPI1.S3 RPI1.3 | RPI1.3
SPI_CE0
  Bottom 0.254: CONN1.16 39.5,22.1 38.86,22.1 38.48,22.48 37.95,22.48 37.59,22.84 37.59,26.49 RPI1.24 RPI1.S24 | RPI1.S24
SPI_CE1
  Bottom 0.254: CONN1.17 42.16,21.21 40.89,22.48 40.49,22.48 40.13,22.84 40.13,26.49 RPI1.26 RPI1.S26 | RPI1.S26
SPI_MISO
  Bottom 0.254: CONN1.14 33.77,22.75 RPI1.S21 RPI1.21 | RPI1.21
SPI_MOSI
  Bottom 0.254: CONN1.13 31.23,22.75 RPI1.S19 RPI1.19
SPI_SCLK
  Bottom 0.254: CONN1.15 36.31,22.75 RPI1.S23 RPI1.23 | RPI1.23
TXD
  Bottom 0.254: RPI1.S8 | RPI1.S8 RPI1.8 | RPI1.S8 15.99,27.59 14.7,26.3 14.7,22.7 14.4,22.4 8.56,22.4 CONN1.3
VMOTOR
  Top 0.406: Q1.4 51.39,9.64
  Top 0.813: 51.39,9.64 MPOWER.2

### Text on the board
Pinguin_tBackup: SCL | RXD | #17 | #27 | #23 | #25 | MISO | CE0 | #5 | #12 | #16 | #20 | SDA | TXD | #4 | #18 | #22 | #24 | MOSI | CLK | CE1 | #6 | #13 | #19 | #21 | 15 | adafruit! | 14 | #1 | M1 | GND | M2 | M3 | GND | M4 | #0 | extra / PWM | 5-12V / Motor / Power | DC & / Stepper / Motor / Bonnet | + | -
Pinguin_bBackup: A0 | A1 | A2 | A3 | A4 | I2C Address